# EAGLE design SparkFun_XBee_Arduino_Shield_Qwiic (EAGLE 9.6.2)
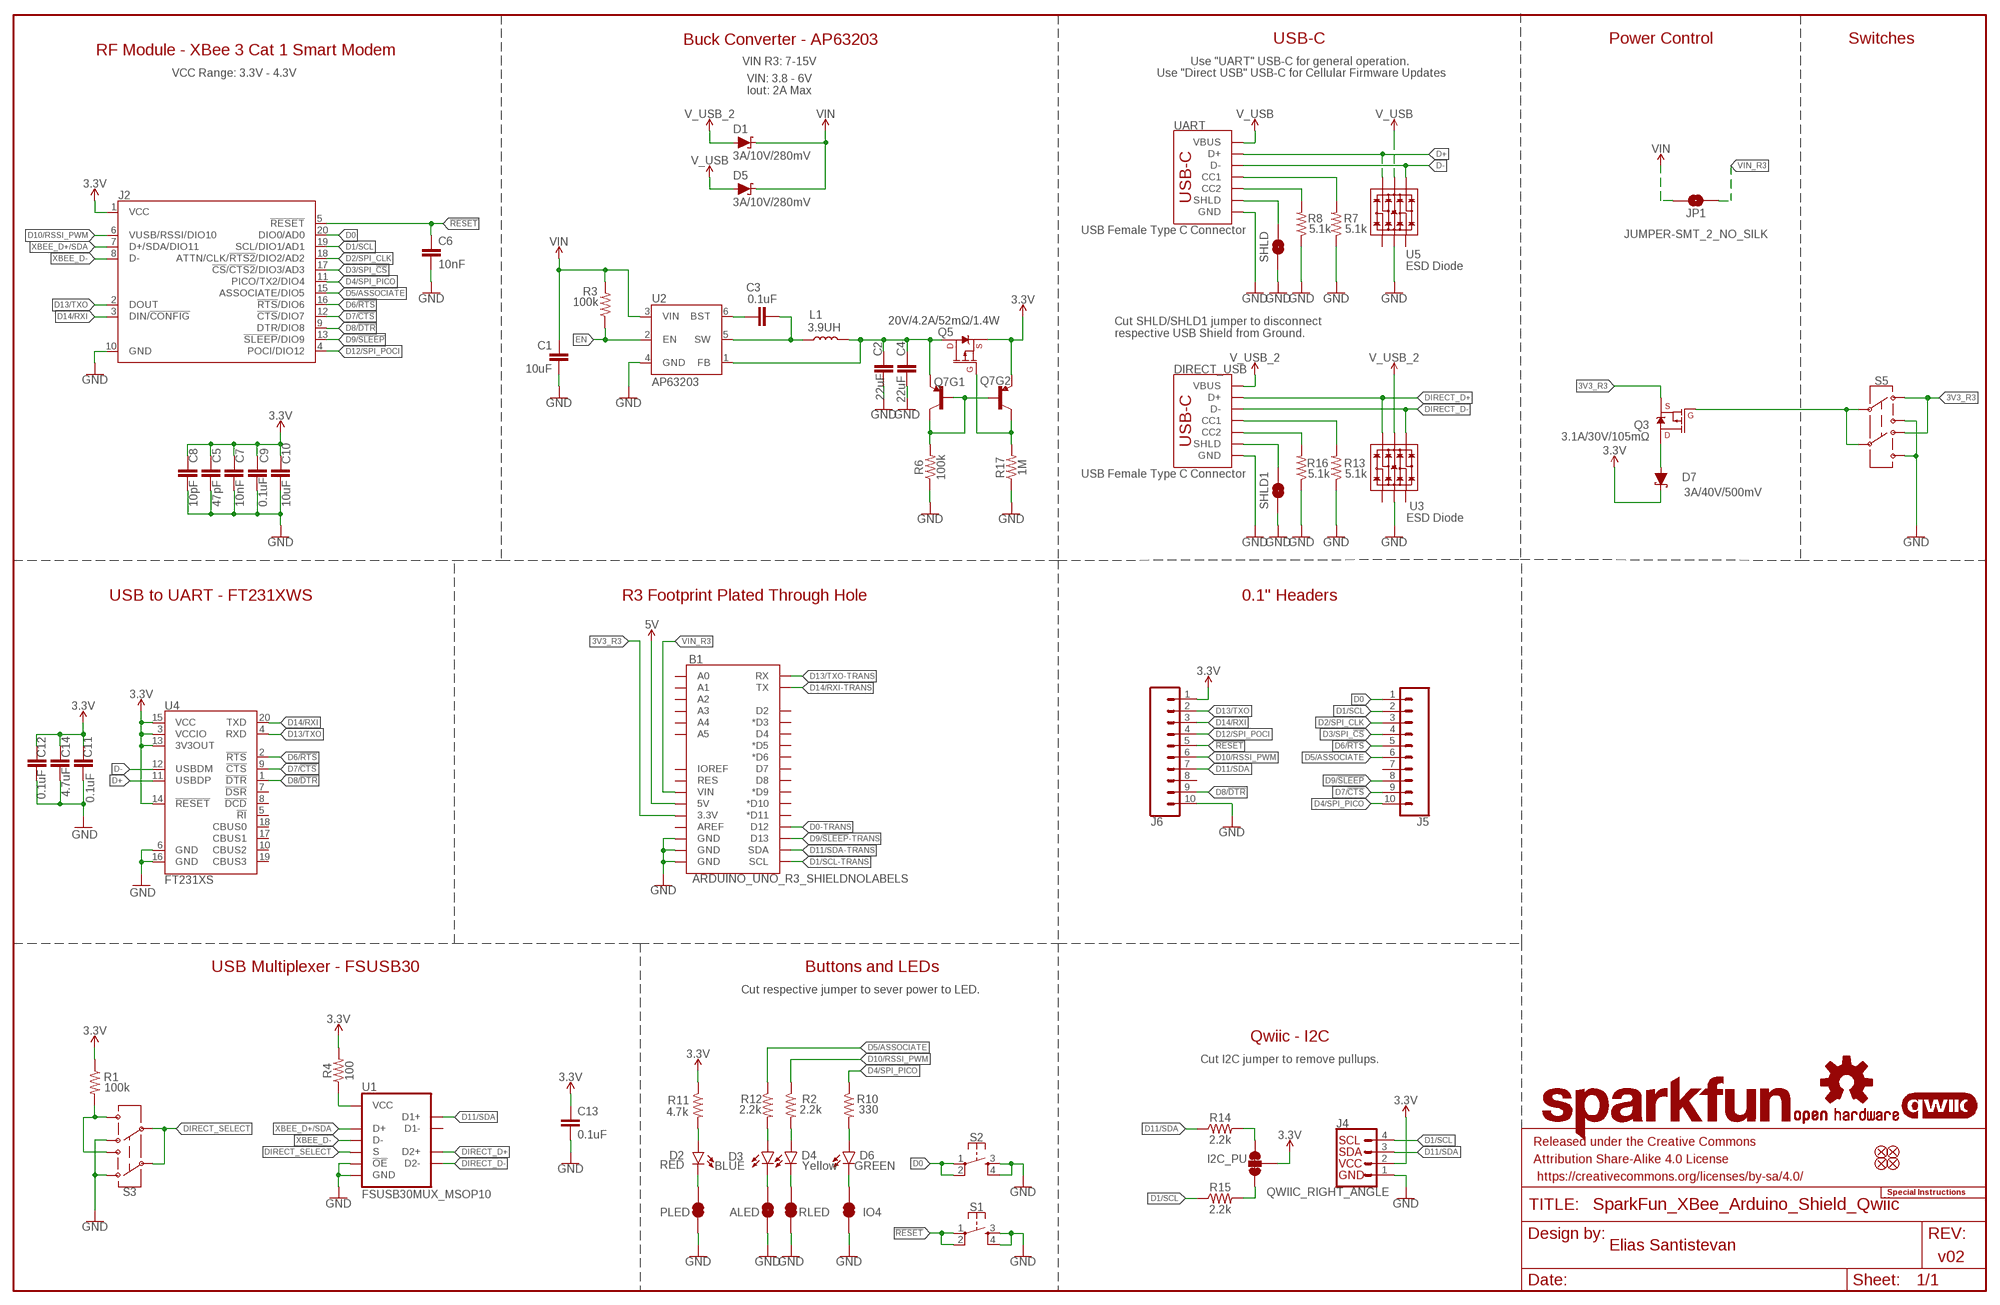
[diagram p0: schematic, sheet 1]

## Parts
ALED  JUMPER-SMT_2_NC_TRACE_SILK  [SMT-JUMPER_2_NC_TRACE_SILK]
B1  ARDUINO_UNO_R3_SHIELDNOLABELS  [UNO_R3_SHIELD_NOLABELS]
C1  10uF  10UF-1210-50V-20%  [1210]
C2  22uF  22UF-0603-6.3V-20%  [0603]
C3  0.1uF  0.1UF-0603-25V-5%  [0603]
C4  22uF  22UF-0603-6.3V-20%  [0603]
C5  47pF  47PF-0603-50V-5%  [0603]
C6  10nF  10NF-0603-50V-10%  [0603]
C7  10nF  10NF-0603-50V-10%  [0603]
C8  10pF  10PF-0603-50V-5%  [0603]
C9  0.1uF  0.1UF-0603-25V-(+80/-20%)  [0603]
C10  10uF  10UF-0603-6.3V-20%  [0603]
C11  0.1uF  0.1UF-0603-25V-(+80/-20%)  [0603]
C12  0.1uF  0.1UF-0603-25V-(+80/-20%)  [0603]
C13  0.1uF  0.1UF-0603-25V-(+80/-20%)  [0603]
C14  4.7uF  4.7UF-0603-6.3V-(10%)  [0603]
D1  3A/10V/280mV  DIODE-SCHOTTKY-BAT60A  [SOD-323]
D2  RED  LED-RED_0603-KB  [LED-0603]
D3  BLUE  LED-BLUE0603  [LED-0603]
D4  Yellow  LED-YELLOW0603  [LED-0603]
D5  3A/10V/280mV  DIODE-SCHOTTKY-BAT60A  [SOD-323]
D6  GREEN  LED-GREEN0603  [LED-0603]
D7  3A/40V/500mV  DIODE-SCHOTTKY-B340A  [SMA-DIODE]
DIRECT_USB  USB Female Type C Connector  USB_C_4-LAYER-ISOLATED  [USB-C-16P-4LAYER-ISOLATED]
FD1  FIDUCIAL1X2  [FIDUCIAL-1X2]
FD2  FIDUCIAL1X2  [FIDUCIAL-1X2]
FD3  FIDUCIAL1X2  [FIDUCIAL-1X2]
FD4  FIDUCIAL1X2  [FIDUCIAL-1X2]
FRAME1  FRAME-LEDGER  [CREATIVE_COMMONS]
I2C_PU  JUMPER-SMT_3_2-NC_TRACE_SILK  [SMT-JUMPER_3_2-NC_TRACE_SILK]
IO4  JUMPER-SMT_2_NC_TRACE_SILK  [SMT-JUMPER_2_NC_TRACE_SILK]
J2  XBEE_UPDATEXBEE_SMD  [XBEE3-SMD]
J4  QWIIC_RIGHT_ANGLE  QWIIC_CONNECTORJS-1MM  [JST04_1MM_RA]
J5  CONN_10NO_SILK_PTH_FEMALE  [1X10_NO_SILK]
J6  CONN_10NO_SILK_PTH_FEMALE  [1X10_NO_SILK]
JP1  JUMPER-SMT_2_NO_SILK  [SMT-JUMPER_2_NO_SILK]
L1  3.9UH  [INDUCTOR_3.9UH]
LOGO1  SFE_LOGO_NAMEBLANK  [BLANK]
LOGO2  OSHW-LOGOS  [OSHW-LOGO-S]
LOGO3  QWIIC_LOGO_4MM  [QWIIC_4MM]
LOGO4  SPECIAL_INSTRUCTIONS-ORDERING  [ORDERING_INSTRUCTIONS]
PLED  JUMPER-SMT_2_NC_TRACE_SILK  [SMT-JUMPER_2_NC_TRACE_SILK]
Q3  3.1A/30V/105mΩ  MOSFET_PCH-DMG2307L  [SOT23-3]
Q5  20V/4.2A/52mΩ/1.4W  MOSFET_PCH-DMG2305UX-7  [SOT23-3]
Q7  TRANS_PNP_DUALSOT-363  [SOT363_PHILIPS]
R1  100k  100KOHM-0603-1/10W-1%  [0603]
R2  2.2k  2.2KOHM-0603-1/10W-1%  [0603]
R3  100k  100KOHM-0603-1/10W-1%  [0603]
R4  100  100OHM-0603-1/10W-1%  [0603]
R6  100k  100KOHM-0603-1/10W-1%  [0603]
R7  5.1k  5.1KOHM5.1KOHM-0603-1/10W-1%  [0603]
R8  5.1k  5.1KOHM5.1KOHM-0603-1/10W-1%  [0603]
R10  330  330OHM-0603-1/10W-1%  [0603]
R11  4.7k  4.7KOHM-0603-1/10W-1%  [0603]
R12  2.2k  2.2KOHM-0603-1/10W-1%  [0603]
R13  5.1k  5.1KOHM5.1KOHM-0603-1/10W-1%  [0603]
R14  2.2k  2.2KOHM-0603-1/10W-1%  [0603]
R15  2.2k  2.2KOHM-0603-1/10W-1%  [0603]
R16  5.1k  5.1KOHM5.1KOHM-0603-1/10W-1%  [0603]
R17  1M  1MOHM-0603-1/4W-5%  [0603]
RLED  JUMPER-SMT_2_NC_TRACE_SILK  [SMT-JUMPER_2_NC_TRACE_SILK]
S1  MOMENTARY-SWITCH-SPST-2-SMD-5.2MM-TALL  [TACTILE_SWITCH_SMD_5.2MM]
S2  MOMENTARY-SWITCH-SPST-2-SMD-5.2MM-TALL  [TACTILE_SWITCH_SMD_5.2MM]
S3  SWITCH-DPDT-SMD-AYZ0202  [SWITCH_DPDT_SMD_AYZ0202]
S5  SWITCH-DPDT-SMD-AYZ0202  [SWITCH_DPDT_SMD_AYZ0202]
SHLD  JUMPER-SMT_2_NC_TRACE_SILK  [SMT-JUMPER_2_NC_TRACE_SILK]
SHLD1  JUMPER-SMT_2_NC_TRACE_SILK  [SMT-JUMPER_2_NC_TRACE_SILK]
U1  FSUSB30MUX_MSOP10  [MSOP10]
U2  AP63203  [SOT23-6]
U3  ESD Diode  TVS_DIODE_ARRAY_DT1042-04SO-7  [SOT-23-6]
U4  FT231XS  [SSOP20_L]
U5  ESD Diode  TVS_DIODE_ARRAY_DT1042-04SO-7  [SOT-23-6]
UART  USB Female Type C Connector  USB_C_4-LAYER-ISOLATED  [USB-C-16P-4LAYER-ISOLATED]

## Nets
3.3V: C5.1 C7.1 C8.1 C9.1 C10.1 C11.1 C12.1 C13.1 C14.1 D7.C I2C_PU.2 J2.1(VCC) J4.2 J6.1 Q5.2(S) Q7.4(E) R1.1 R4.2 R11.1 U4.3(VCCIO) U4.13(3V3OUT) U4.14(!RESET) U4.15(VCC)
3.3V_VREG: C2.1 C4.1 L1.P$2 Q5.3(D) Q7.1(E) U2.1(FB)
3V3_R3: B1.3.3V Q3.2(S) S5.3 S5.6
5V: B1.5V
!RESET!: C6.1 J2.5(!RESET!) J6.5 S1.1 S1.2
D0: J2.20(DIO0/AD0) J5.1 S2.1 S2.2
D0-TRANS: B1.D12
D1/SCL: J2.19(SCL/DIO1/AD1) J4.4 J5.2 R15.1
D1/SCL-TRANS: B1.SCL
D2/SPI_CLK: J2.18(ATTN/CLK/!RTS2!/DIO2/AD2) J5.3
D3/SPI_!CS!: J2.17(!CS!/!CTS2!/DIO3/AD3) J5.4
D4/SPI_PICO: J2.11(PICO/TX2/DIO4) J5.10 R10.1
D5/ASSOCIATE: J2.15(ASSOCIATE/DIO5) J5.6 R12.1
D6/!RTS!: J2.16(!RTS!/DIO6) J5.5 U4.2(!RTS)
D7/!CTS!: J2.12(!CTS!/DIO7) J5.9 U4.9(!CTS)
D8/!DTR!: J2.9(DTR/DIO8) J6.9 U4.1(!DTR)
D9/!SLEEP!: J2.13(!SLEEP!/DIO9) J5.8
D9/!SLEEP!-TRANS: B1.D13
D10/RSSI_PWM: J2.6(VUSB/RSSI/DIO10) J6.6 R2.1
D11/SDA: J4.3 J6.7 R14.1 U1.2(D1+)
D11/SDA-TRANS: B1.SDA
D12/SPI_POCI: J2.4(POCI/DIO12) J6.4
D13/TXO: J2.2(DOUT) J6.2 U4.4(RXD)
D13/TXO-TRANS: B1.RX
D14/RXI: J2.3(DIN/!CONFIG!) J6.3 U4.20(TXD)
D14/RXI-TRANS: B1.TX
D+ [Diff pairs]: U4.11(USBDP) U5.6(IO4) UART.A6(D+) UART.B6(D+)
D- [Diff pairs]: U4.12(USBDM) U5.4(IO3) UART.A7(D-) UART.B7(D-)
DIRECT_D+ [Diff pairs]: DIRECT_USB.A6(D+) DIRECT_USB.B6(D+) U1.3(D2+) U3.6(IO4)
DIRECT_D- [Diff pairs]: DIRECT_USB.A7(D-) DIRECT_USB.B7(D-) U1.7(D2-) U3.4(IO3)
DIRECT_SELECT: S3.2 S3.5 U1.1(S)
DIRECT_USB: R1.2 S3.1 S3.4
EN: R3.1 U2.2(EN)
GND: ALED.1 B1.GND@0(GND) B1.GND@1(GND) B1.GND@2(GND) C1.2 C2.2 C4.2 C5.2 C6.2 C7.2 C8.2 C9.2 C10.2 C11.2 C12.2 C13.2 C14.2 DIRECT_USB.GND DIRECT_USB.GND2(GND) IO4.1 J2.10(GND) J4.1 J6.10 PLED.1 R6.1 R7.1 R8.1 R13.1 R16.1 R17.1 RLED.1 S1.3 S1.4 S2.3 S2.4 S3.3 S3.6 S5.1 S5.4 SHLD1.1 SHLD.1 U1.5(GND) U1.9(!OE!) U2.4(GND) U3.2(VSS) U4.6(GND) U4.16(GND) U5.2(VSS) UART.GND UART.GND2(GND)
N$1: C3.1 U2.6(BST)
N$2: D4.A R2.2
N$3: D4.C RLED.2
N$4: D6.A R10.2
N$5: R8.2 UART.B5(CC2)
N$6: R7.2 UART.A5(CC1)
N$7: D2.A R11.2
N$8: C3.2 L1.P$1 U2.5(SW)
N$10: R4.1 U1.10(VCC)
N$11: I2C_PU.3 R14.2
N$12: D3.A R12.2
N$13: I2C_PU.1 R15.2
N$14: DIRECT_USB.B5(CC2) R16.2
N$15: DIRECT_USB.A5(CC1) R13.2
N$16: D7.A Q3.3(D)
N$17: D6.C IO4.2
N$19: Q7.2(B) Q7.5(B) Q7.6(C) R6.2
N$20: Q5.1(G) Q7.3(C) R17.2
N$21: ALED.2 D3.C
N$23: D2.C PLED.2
N$27: Q3.1(G) S5.2 S5.5
SHLD: SHLD.2 UART.SHLD1(SHLD) UART.SHLD2(SHLD) UART.SHLD3(SHLD) UART.SHLD4(SHLD) UART.SHLD5(SHLD) UART.SHLD6(SHLD) UART.SHLD7(SHLD) UART.SHLD8(SHLD)
SHLD1: DIRECT_USB.SHLD1(SHLD) DIRECT_USB.SHLD2(SHLD) DIRECT_USB.SHLD3(SHLD) DIRECT_USB.SHLD4(SHLD) DIRECT_USB.SHLD5(SHLD) DIRECT_USB.SHLD6(SHLD) DIRECT_USB.SHLD7(SHLD) DIRECT_USB.SHLD8(SHLD) SHLD1.2
V_USB: D5.A U5.5(VCC) UART.VBUS1(VBUS) UART.VBUS2(VBUS)
V_USB_2: D1.A DIRECT_USB.VBUS1(VBUS) DIRECT_USB.VBUS2(VBUS) U3.5(VCC)
VIN: C1.1 D1.C D5.C JP1.2 R3.2 U2.3(VIN)
VIN_R3: B1.VIN JP1.1
XBEE_D+/SDA [Diff pairs]: J2.7(D+/SDA/DIO11) U1.4(D+)
XBEE_D- [Diff pairs]: J2.8(D-) U1.6(D-)
Unconnected: B1.A0 B1.A1 B1.A2 B1.A3 B1.A4 B1.A5 B1.AREF B1.D2 B1.D3(*D3) B1.D4 B1.D5(*D5) B1.D6(*D6) B1.D7 B1.D8 B1.D9(*D9) B1.D10(*D10) B1.D11(*D11) B1.IOREF B1.RES J5.7 J6.8 U1.8(D1-) U3.1(IO1) U3.3(IO2) U4.5(!RI) U4.7(!DSR) U4.8(!DCD) U4.10(CBUS2) U4.17(CBUS1) U4.18(CBUS0) U4.19(CBUS3) U5.1(IO1) U5.3(IO2)

## Notes on the sheet
- Buck Converter - AP63203 | USB-C | Power Control | Switches
- RF Module - XBee 3 Cat 1 Smart Modem
- VIN R3: 7-15V | Use "UART" USB-C for general operation.
- VCC Range: 3.3V - 4.3V | Use "Direct USB" USB-C for Cellular Firmware Updates
- VIN: 3.8 - 6V
  Iout: 2A Max
- Cut SHLD/SHLD1 jumper to disconnect
  respective USB Shield from Ground.
- USB to UART - FT231XWS | R3 Footprint Plated Through Hole | 0.1" Headers
- USB Multiplexer - FSUSB30 | Buttons and LEDs
- Cut respective jumper to sever power to LED.
- Qwiic - I2C
- Cut I2C jumper to remove pullups.
- Elias Santistevan
- v02

## Library data of the parts
ALED IO4 PLED RLED SHLD SHLD1 = SparkFun-Jumpers:JUMPER-SMT_2_NC_TRACE: Normally closed trace jumper This jumper has a trace between two pads so it's normally closed (NC). Use a razor knife to open the connection. For best results follow the IPC guidelines for cutting traces: Cutout at least 0.063 mm (0.005 in). Remove all loose material to clean up the cut area. Seal the cut with an approved epoxy. Reapply solder to reclose the connection.
B1 = SparkFun-Boards:ARDUINO_UNO_R3_SHIELD: Arduino R3 Shield Footprint Shield form compatible with the Arduino Uno R3. SparkFun Products: MG2639 Cellular Shield <https://www.sparkfun.com/products/13120> MIDI Shield <https://www.sparkfun.com/products/12898> R3 Stackable Headers Kit <https://www.sparkfun.com/products/11417>
C1 = SparkFun-Capacitors:10UF: 10.0µF ceramic capacitors A capacitor is a passive two-terminal electrical component used to store electrical energy temporarily in an electric field.; PROD_ID: CAP-09824
C2 C4 = SparkFun-Capacitors:22UF: 22µF ceramic capacitors A capacitor is a passive two-terminal electrical component used to store electrical energy temporarily in an electric field.; PROD_ID: CAP-14464
C3 = SparkFun-Capacitors:0.1UF: 0.1µF ceramic capacitors A capacitor is a passive two-terminal electrical component used to store electrical energy temporarily in an electric field.; PROD_ID: CAP-08604
C5 = SparkFun-Capacitors:47PF: 47pF ceramic capacitors A capacitor is a passive two-terminal electrical component used to store electrical energy temporarily in an electric field.; PROD_ID: CAP-08913
C6 C7 = SparkFun-Capacitors:10NF: 0.01uF/10nF/10,000pF ceramic capacitors A capacitor is a passive two-terminal electrical component used to store electrical energy temporarily in an electric field. CAP-09321; PROD_ID: CAP-00867
C8 = SparkFun-Capacitors:10PF: 10pF ceramic capacitors A capacitor is a passive two-terminal electrical component used to store electrical energy temporarily in an electric field.; PROD_ID: CAP-11812
C9 C11-C13 = SparkFun-Capacitors:0.1UF: 0.1µF ceramic capacitors A capacitor is a passive two-terminal electrical component used to store electrical energy temporarily in an electric field.; PROD_ID: CAP-00810
C10 = SparkFun-Capacitors:10UF: 10.0µF ceramic capacitors A capacitor is a passive two-terminal electrical component used to store electrical energy temporarily in an electric field.; PROD_ID: CAP-11015
C14 = SparkFun-Capacitors:4.7UF: 4.7µF ceramic capacitors A capacitor is a passive two-terminal electrical component used to store electrical energy temporarily in an electric field.; PROD_ID: CAP-08280
D1 D5 = SparkFun-DiscreteSemi:DIODE-SCHOTTKY: Schottky diode A Schottky diode is a semiconductor diode which has a low forward voltage drop and a very fast switching action.; PROD_ID: DIO-14072
D2 = SparkFun-LED:LED-RED: Red SMD LED Used in manufacturing of most products at SparkFun Packages: 0603 - KB - KingBright (DIO-17976) SMD 0603 package [Datasheet] <https://www.kingbrightusa.com/images/catalog/SPEC/APT1608SURCK.pdf> 0603 - (DIO-00819, has gone EOL) SMD 0603 package 0603 SMART - SMD 0603 SMART package ( more efficient and expensive)[Product Link] <http://www.osram-os.com/Graphics/XPic2/00077099_0.pdf> 1206 - SMD1206 package [Product Link] <https://www.sparkfun.com/datasheets/DevTools/LilyPad/Q150OVS4.pdff> SparkFun Products: Pro Mini 328 -5V <https://www.sparkfun.com/products/821> RedBoard <https://www.sparkfun.com/products/12757> IOIO-OTG <https://www.sparkfun.com/products/13613>; PROD_ID: DIO-17976
D3 = SparkFun-LED:LED-BLUE: Blue SMD LED Used in manufacturing of various products at SparkFun Packages: 0603 - SMD 0603 package [Product Link] <http://www.digikey.com/product-detail/en/SMLE12BC7TT86/511-1589-2-ND/1641808> 1206 - SMD1206 package [Product Link] <http://www.digikey.com/product-detail/en/lite-on-inc/LTST-C150TBKT/160-1643-1-ND/573584> SparkFun Products: ESP8266 Thing-Dev Board <https://www.sparkfun.com/products/13711> RedBoard <https://www.sparkfun.com/products/12757>; PROD_ID: DIO-08575
D4 = SparkFun-LED:LED-YELLOW: Yellow SMD LED Used in manufacturing several products at SparkFun. Packages: 0603 - SMD 0603 package[Product Link] <http://www.kingbrightusa.com/product.asp?catalog_name=LED&product_id=APT1608SYCK> 0603 -SMART - SMART SMD 0603 package (more efficient/more expensive) [Product Link] <http://www.osram-os.com/osram_os/en/products/product-catalog/led-light-emitting-diodes/smartled-0603/ly-l29k/index.jsp> LilyPad - SMD1206 package[Product Datasheet] <https://www.sparkfun.com/datasheets/DevTools/LilyPad/Q150YUS4.pdf> SparkFun Products: Blynk Board <https://www.sparkfun.com/products/13794> IOIO-OTG <https://www.sparkfun.com/products/13613> XBee Explorer Serial <https://www.sparkfun.com/products/13225>; PROD_ID: DIO-09003
D6 = SparkFun-LED:LED-GREEN: Green SMD LED Used in manufacturing of various products at SparkFun Packages: 0603 - SMD 0603 package [Product Link] <http://www.futureelectronics.com/en/technologies/semiconductors/optoelectronics/leds/Pages/9894312-LTST-C190GKT.aspx?CrossPart=HSMG-C190&IM=0> LilyPad 1206 - SMD1206 LilyPad package [Product Link] <http://www.futureelectronics.com/en/Technologies/Product.aspx?ProductID=IN150NGHARVATEKCORPORATION2049943&IM=0> 1206 - SMD1206 package [Product Link] <http://www.futureelectronics.com/en/technologies/semiconductors/optoelectronics/leds/Pages/8315665-LTST-C150KGKT.aspx?IM=0> 1206 Bottom Mount -SMD 1206 Bottom Mount [Product Link] <http://www.digikey.com/product-detail/en/lite-on-inc/LTST-C230KGKT/160-1456-1-ND/386854> SparkFun Products: Pro Mini 328 -5V <https://www.sparkfun.com/products/821> RedBoard <https://www.sparkfun.com/products/12757> MP3 Trigger <https://www.sparkfun.com/products/13720> Makey Makey <https://www.sparkfun.com/products/11076>; PROD_ID: DIO-00821
D7 = SparkFun-DiscreteSemi:DIODE-SCHOTTKY: Schottky diode A Schottky diode is a semiconductor diode which has a low forward voltage drop and a very fast switching action.; PROD_ID: DIO-09886
DIRECT_USB UART = SparkFun-Connectors:USB_C: USB Type C 16Pin Connector Super Speed pins not available on the 16-pin purely SMD connector so this part is best for USB 2.0 implementations. D1 and D2 are tied together enabling D+/- no matter which way the cable is plugged into the connector. The two channel configuration pins (CC1/2) are exposed. These are normally connected to ground via 5.1k resistors but can be reconfigured for high current/high power applications. **4-LAYER BOARD WARNING!!** If designing 4-layer board, make sure to select the variant _4-LAYER-ISOLATED. The linked footprint (USB-C-16-4LAYER-ISOLATED) includes some very necessary cutout polygons in the inner layers (2 and 15). This prevents the PTH mounting shield legs on the USB connector from electrically connecting any other polygons on the inner layers (usually VCC and GND).; PROD_ID: CONN-14122
FD1-FD4 = SparkFun-Aesthetics:FIDUCIAL: Fiducial Alignment Points Point-of-reference for pick-and-place machines and other optical instruments.
FRAME1 = SparkFun-Aesthetics:FRAME-LEDGER: Schematic Frame - Ledger Standard 11x14 US Ledger frame
I2C_PU = SparkFun-Jumpers:JUMPER-SMT_3_2-NC_TRACE: Normally closed trace jumper (2 of 2 connections) This jumper has a trace between all three pads so they are normally closed (NC). Use a razor knife to open the connection(s). For best results follow the IPC guidelines for cutting traces: Cutout at least 0.063 mm (0.005 in). Remove all loose material to clean up the cut area. Seal the cut with an approved epoxy. Reapply solder to reclose the connection(s).
J2 = xbee_smart_modem:XBEE_UPDATE: XBee 3 Cat 1 Smart Modem
J4 = SparkFun-Connectors:QWIIC_CONNECTOR: SparkFun I2C Standard Qwiic Connector An SMD 1mm pitch JST connector makes it easy and quick (get it? Qwiic?) to connect I2C devices to each other. The Qwiic system <http://www.sparkfun.com/qwiic> enables fast and solderless connection between popular platforms and various sensors and actuators. We carry 200mm <https://www.sparkfun.com/products/14204>, 100mm <https://www.sparkfun.com/products/14205>, 50mm <https://www.sparkfun.com/products/14206>, and breadboard friendly <https://www.sparkfun.com/products/14207> Qwiic cables. We also offer 10 pcs strips <https://www.sparkfun.com/products/14323> the SMD connectors.; PROD_ID: CONN-13694
J5 J6 = SparkFun-Connectors:CONN_10: Multi connection point. Often used as Generic Header-pin footprint for 0.1 inch spaced/style header connections On any of the 0.1 inch spaced packages, you can populate with these: Break Away Headers - Straight <https://www.sparkfun.com/products/116> (PRT-00116) Break Away Male Headers - Right Angle <https://www.sparkfun.com/products/553> (PRT-00553) Female Headers <https://www.sparkfun.com/products/115> (PRT-00115) Break Away Headers - Machine Pin <https://www.sparkfun.com/products/117> (PRT-00117) Break Away Female Headers - Swiss Machine Pin <https://www.sparkfun.com/products/743> (PRT-00743) Arduino Stackable Header - 10 Pin <https://www.sparkfun.com/products/11376> (PRT-11376) For SCREWTERMINALS and SPRING TERMINALS visit here: Screw Terimnals on SparkFun.com <https://www.sparkfun.com/search/results?term=Screw+Terminals> (5mm/3.5mm/2.54mm spacing) This device is also useful as a general connection point to wire up your design to another part of your project. Our various solder wires solder well into these plated through hole pads. Hook-Up Wire - Assortment (Stranded, 22 AWG) <https://www.sparkfun.com/products/11375> (PRT-11375) Hook-Up Wire - Assortment (Solid Core, 22 AWG) <https://www.sparkfun.com/products/11367> (PRT-11367) View the entire wire category on our website here <https://www.sparkfun.com/categories/141> Special notes: Molex polarized connector foot print use with SKU : PRT-08231 with associated crimp pins and housings. 1MM SMD Version SKU: PRT-10208 NOTES ON THE VARIANTS LOCK and LOCK_LONGPADS... This footprint was designed to help hold the alignment of a through-hole component (i.e. 6-pin header) while soldering it into place. You may notice that each hole has been shifted either up or down by 0.005 of an inch from it's more standard position (which is a perfectly straight line). This slight alteration caused the pins (the squares in the middle) to touch the edges of the holes. Because they are alternating, it causes a "brace" to hold the component in place. 0.005 has proven to be the perfect amount of "off-center" position when using our standard breakaway headers. Although looks a little odd when you look at the bare footprint, once you have a header in there, the alteration is very hard to notice. Also,if you push a header all the way into place, it is covered up entirely on the bottom side.
JP1 = SparkFun-Jumpers:JUMPER-SMT_2_NO: Normally open jumper This jumper has two pads in close proximity to each other. Apply solder to close the connection. Round pads are easier to solder for beginners, but are a lot larger. SparkFun Product that uses the round pads: SparkFun EL Sequencer <https://www.sparkfun.com/products/12781>
L1 = SparkFun-Coils:3.9UH: Würth's Electronik 3.9uH Inductor Characteristics 3.9uH 2.4A Current Rating 2.8A Saturation Inductance Frequency: 100kHzd AEC-Q200 Certified 5mm x 5mm Package 30% tolerance; PROD_ID: NDUC-18014
LOGO1 = SparkFun-Aesthetics:SFE_LOGO_NAME: SparkFun Font Logo This is the SparkFun name logo. The logo on the schematic will always be the same size; the package variant is the height of the flame part of the logo (or the height the flame would be, if it were drawn). Default layer for the logo on the board is tSilk.
LOGO2 = SparkFun-Aesthetics:OSHW-LOGO: Open-Source Hardware (OSHW) Logo This logo indicates the piece of hardware it is found on incorporates a OSHW license and/or adheres to the definition of open source hardware found here: http://freedomdefined.org/OSHW
LOGO3 = SparkFun-Aesthetics:QWIIC_LOGO: Qwiic Logos for placement on schematic and PCB. The 5.5mm silk logo is best for placing next to Qwiic connector.
LOGO4 = SparkFun-Aesthetics:SPECIAL_INSTRUCTIONS: Special Ordering/Production Instructions Alert Symbol for special PCB ordering instructions or unique production process warnings. Ordering Instructions Production Instructions Types of information that should be added to box: Copper weight Soldermask color Silk color PCB thickness Number of layers PCB Standard: 1.6mm FR4 1 oz copper immersion silver plating red soldermask white silkscreen Types of information that should be added to box: Special wash requirements Depaneling instructions Humidification Glue curing Default text settings: 0.07 inch 9% ratio 50% line distance
Q3 = SparkFun-DiscreteSemi:MOSFET_PCH: P-channel MOSFETs Voltage controlled devices that allow control of high current outputs. SparkFun Products: SparkFun ESP32 Thing <https://www.sparkfun.com/products/13907> SparkFun ESP8266 Thing <https://www.sparkfun.com/products/13231> SparkFun Pi Servo HAT V2 <https://www.sparkfun.com/products/15316> DMG2305UX-7 (20V/4.2A/SOT23-3); PROD_ID: TRANS-11308
Q5 = SparkFun-DiscreteSemi:MOSFET_PCH: P-channel MOSFETs Voltage controlled devices that allow control of high current outputs. SparkFun Products: SparkFun ESP32 Thing <https://www.sparkfun.com/products/13907> SparkFun ESP8266 Thing <https://www.sparkfun.com/products/13231> SparkFun Pi Servo HAT V2 <https://www.sparkfun.com/products/15316> DMG2305UX-7 (20V/4.2A/SOT23-3); PROD_ID: TRANS-14388
Q7 = SparkFun-DiscreteSemi:TRANS_PNP_DUAL: Dual PNP Transistors in Single Package The BCM857BS puts two PNP transistors in a single package. Bipolar (BJT) Transistor Array 2 PNP (Dual) 45V 100mA 100MHz 200mW Surface Mount SOT-363 Datasheet <https://www.diodes.com/assets/Datasheets/BCM857BS.pdf> SparkFun Products: SparkFun Pi Servo HAT V2 <https://www.sparkfun.com>; PROD_ID: TRANS-14386
R1 R3 R6 = SparkFun-Resistors:100KOHM: 100kΩ resistor A resistor is a passive two-terminal electrical component that implements electrical resistance as a circuit element. Resistors act to reduce current flow, and, at the same time, act to lower voltage levels within circuits. - Wikipedia; PROD_ID: RES-07828
R2 R12 R14 R15 = SparkFun-Resistors:2.2KOHM: 2.2kΩ resistor A resistor is a passive two-terminal electrical component that implements electrical resistance as a circuit element. Resistors act to reduce current flow, and, at the same time, act to lower voltage levels within circuits. - Wikipedia; PROD_ID: RES-08272
R4 = SparkFun-Resistors:100OHM: 100Ω resistor A resistor is a passive two-terminal electrical component that implements electrical resistance as a circuit element. Resistors act to reduce current flow, and, at the same time, act to lower voltage levels within circuits. - Wikipedia; PROD_ID: RES-07863
R7 R8 R13 R16 = SparkFun-Resistors:5.1KOHM; PROD_ID: RES-12083
R10 = SparkFun-Resistors:330OHM: 330Ω resistor A resistor is a passive two-terminal electrical component that implements electrical resistance as a circuit element. Resistors act to reduce current flow, and, at the same time, act to lower voltage levels within circuits. - Wikipedia; PROD_ID: RES-00818
R11 = SparkFun-Resistors:4.7KOHM: 4.7kΩ resistor A resistor is a passive two-terminal electrical component that implements electrical resistance as a circuit element. Resistors act to reduce current flow, and, at the same time, act to lower voltage levels within circuits. - Wikipedia; PROD_ID: RES-07857
R17 = SparkFun-Resistors:1MOHM: 1MΩ resistor A resistor is a passive two-terminal electrical component that implements electrical resistance as a circuit element. Resistors act to reduce current flow, and, at the same time, act to lower voltage levels within circuits. - Wikipedia; PROD_ID: RES-07868
S1 S2 = SparkFun-Switches:MOMENTARY-SWITCH-SPST-2: Momentary Switch (Pushbutton) - SPST - Two Circuits Normally-open (NO) SPST momentary switches (buttons, pushbuttons). Schematic symbol includes two switch circuits. Variants SMD-4.6MMX2.8MM - 4.60mm x 2.80mm Tactile Momentary Button Switch - Used on SparkFun Pro Micro - RP2040 <https://www.sparkfun.com/products/17717> SMD-5.2MM - Mini Pushbutton Switch - SMD <https://www.sparkfun.com/products/8720> - Used on Arduino Pro Mini <https://www.sparkfun.com/products/11114>; PROD_ID: SWCH-14139
S3 S5 = SparkFun-Switches:SWITCH-DPDT: Double-Pole, Double-Throw (DPDT) Switch Double-pole, double-throw switches. Variant Overview PTH-GPI-152-3013 Used on SparkFun Geiger Counter <https://www.sparkfun.com/products/11345> SMD-AY0202 Surface Mount DPDT Switch <https://www.sparkfun.com/products/597> (COM-00597) Used on e.g. LilyPad Arduino USB - ATmega32U4 Board <https://www.sparkfun.com/products/12049>; PROD_ID: SWCH-08179; SF_SKU: COM-00597
U1 = SparkFun-IC-Special-Function:FSUSB30MUX; PROD_ID: IC-15569
U2 = SparkFun-IC-Power:AP63203: Diodes Inc. AP63203 3.8V-32V input 3.3V Buck The AP63200/AP63201/AP63203/AP63205 is a 2A, synchronous buck converter with a wide input voltage range of 3.8V to 32V and fully integrates a 125mΩ high-side power MOSFET and a 68mΩ lowside power MOSFET to provide high-efficiency step-down DC/DC conversion; PROD_ID: VREG-15244
U3 U5 = SparkFun-DiscreteSemi:TVS_DIODE_ARRAY; PROD_ID: IC-13538
U4 = SparkFun-IC-Comms:FT231X: FTDI FT231X Full Speed USB to Full-handshake UART This USB2.0 Full Speed IC offers a compact bridge to full handshake UART interfaces. The device is a UART, capable of operating up to 3MBaud, with low power consumption (8mA). The FT231X includes the complete FT-X series feature set and enables USB to be added into a system design quickly and easily over a UART interface. Datasheet <http://cdn.sparkfun.com/datasheets/Components/General%20IC/DS_FT231X.pdf> SparkFun Products SparkFun RedBoard - Programmed with Arduino <https://www.sparkfun.com/products/12757> (DEV-12757) SparkFun XBee Explorer USB <https://www.sparkfun.com/products/11812> (WRL-11812) SparkFun XBee Explorer Dongle <https://www.sparkfun.com/products/11697> (WRL-11697) SparkFun Blynk Board - ESP8266 <https://www.sparkfun.com/products/13794> (WRL-13794) SparkFun ESP8266 Thing - Dev Board <https://www.sparkfun.com/products/13711> (WRL-13711) SparkFun Block for Intel® Edison - Base <https://www.sparkfun.com/products/13045> (DEV-13045) SparkFun RedStick <https://www.sparkfun.com/products/13741> (DEV-13741) SparkFun Beefy 3 - FTDI Basic Breakout <https://www.sparkfun.com/products/13746> (DEV-13746) SparkFun FT231X Breakout <https://www.sparkfun.com/products/11736> (BOB-11736); PROD_ID: IC-11524

## Net classes
1 POWER: width 0.559 mm, drill 0.305 mm
2 Diff pairs: width 0.203 mm, drill 0.305 mm, clearance 0.152 mm

## Board
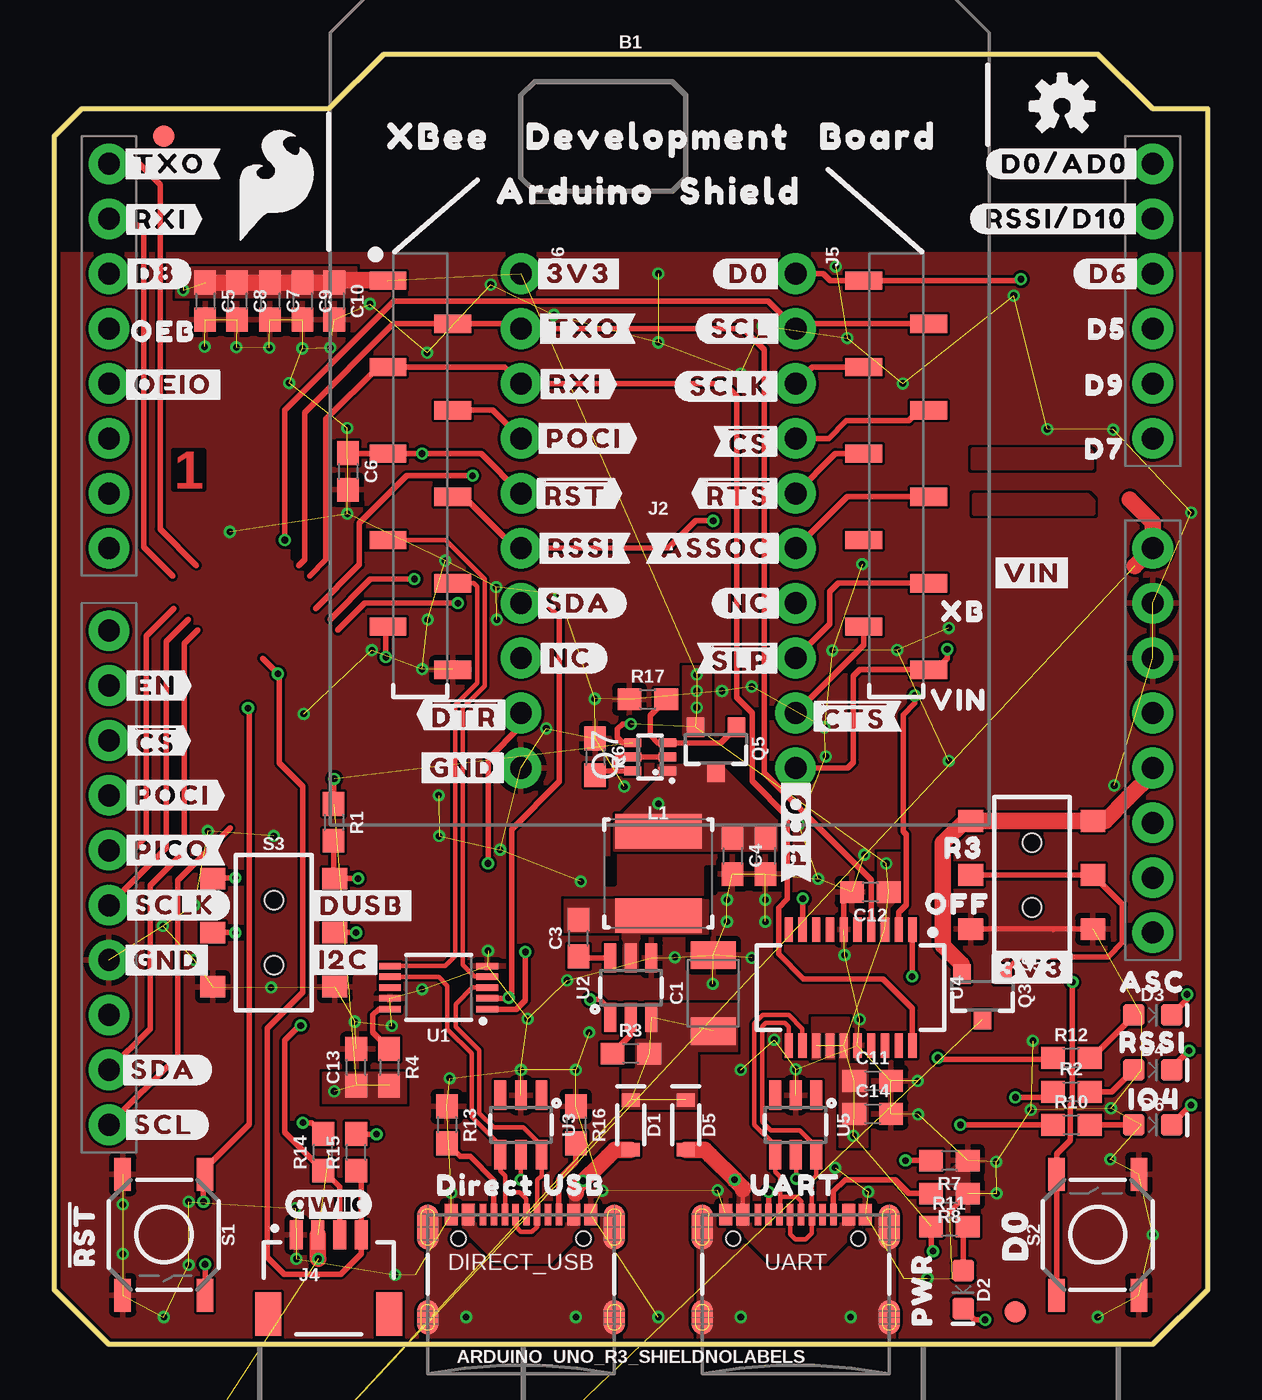
[diagram p1: board, top side]
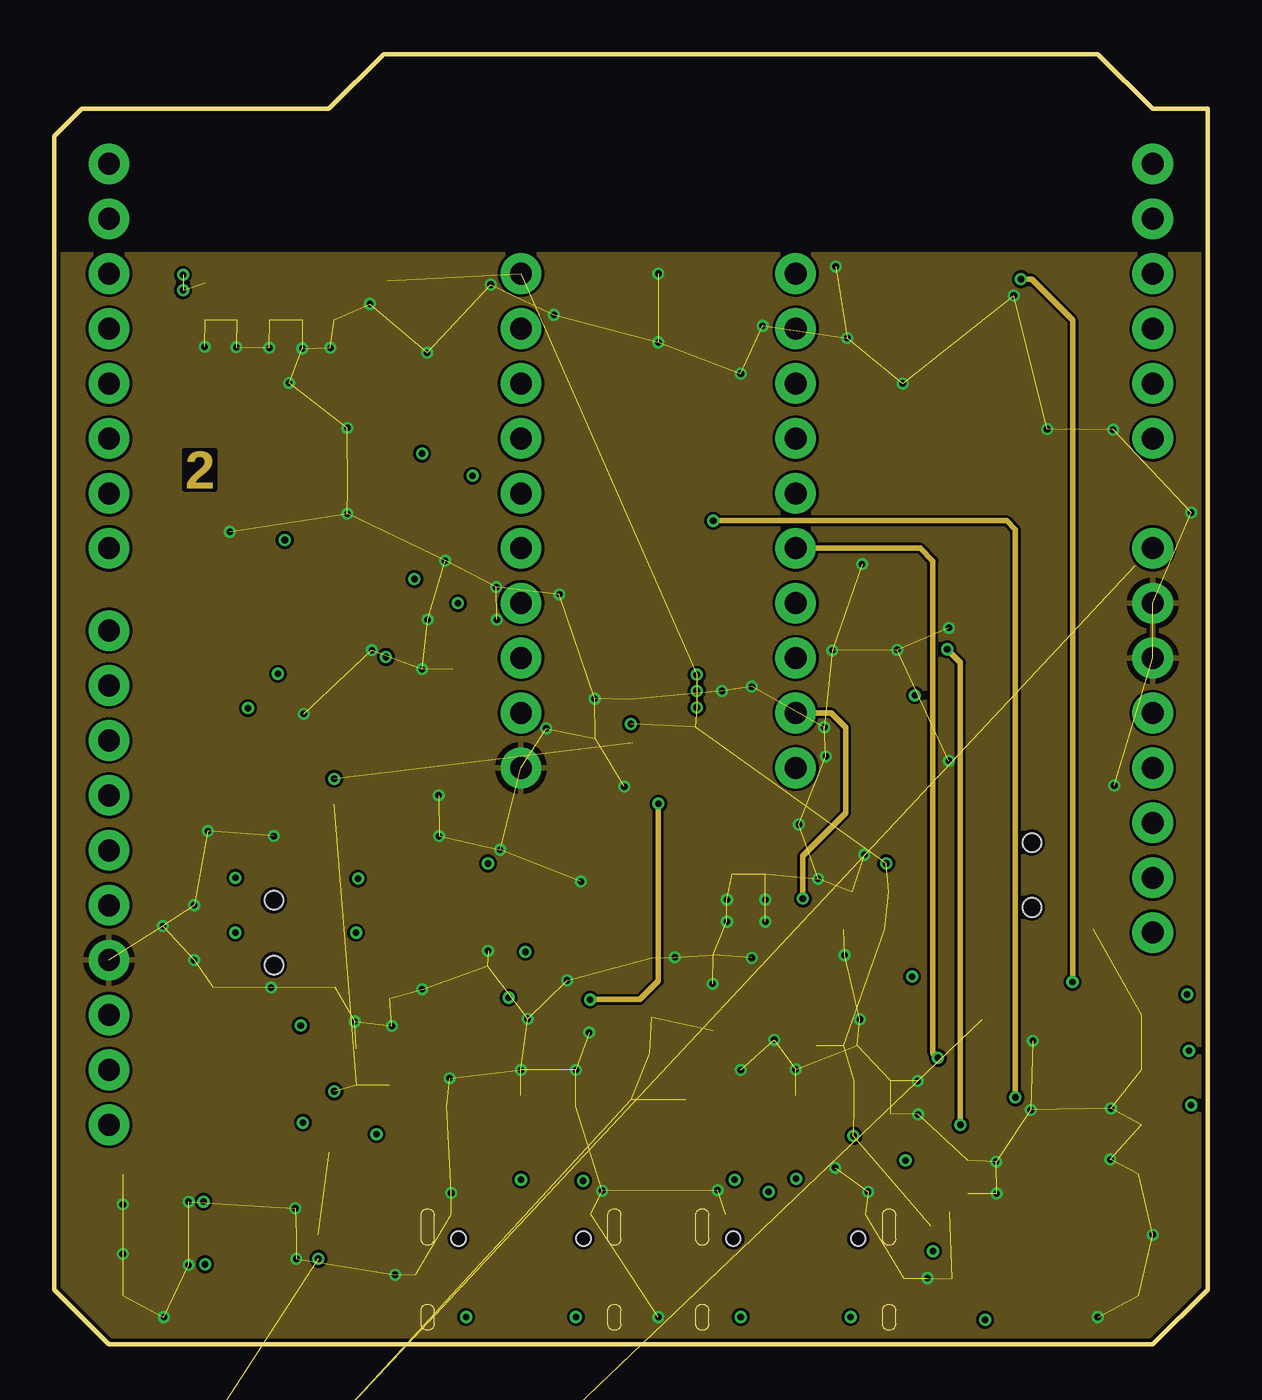
[diagram p2: board, inner layer Route2]
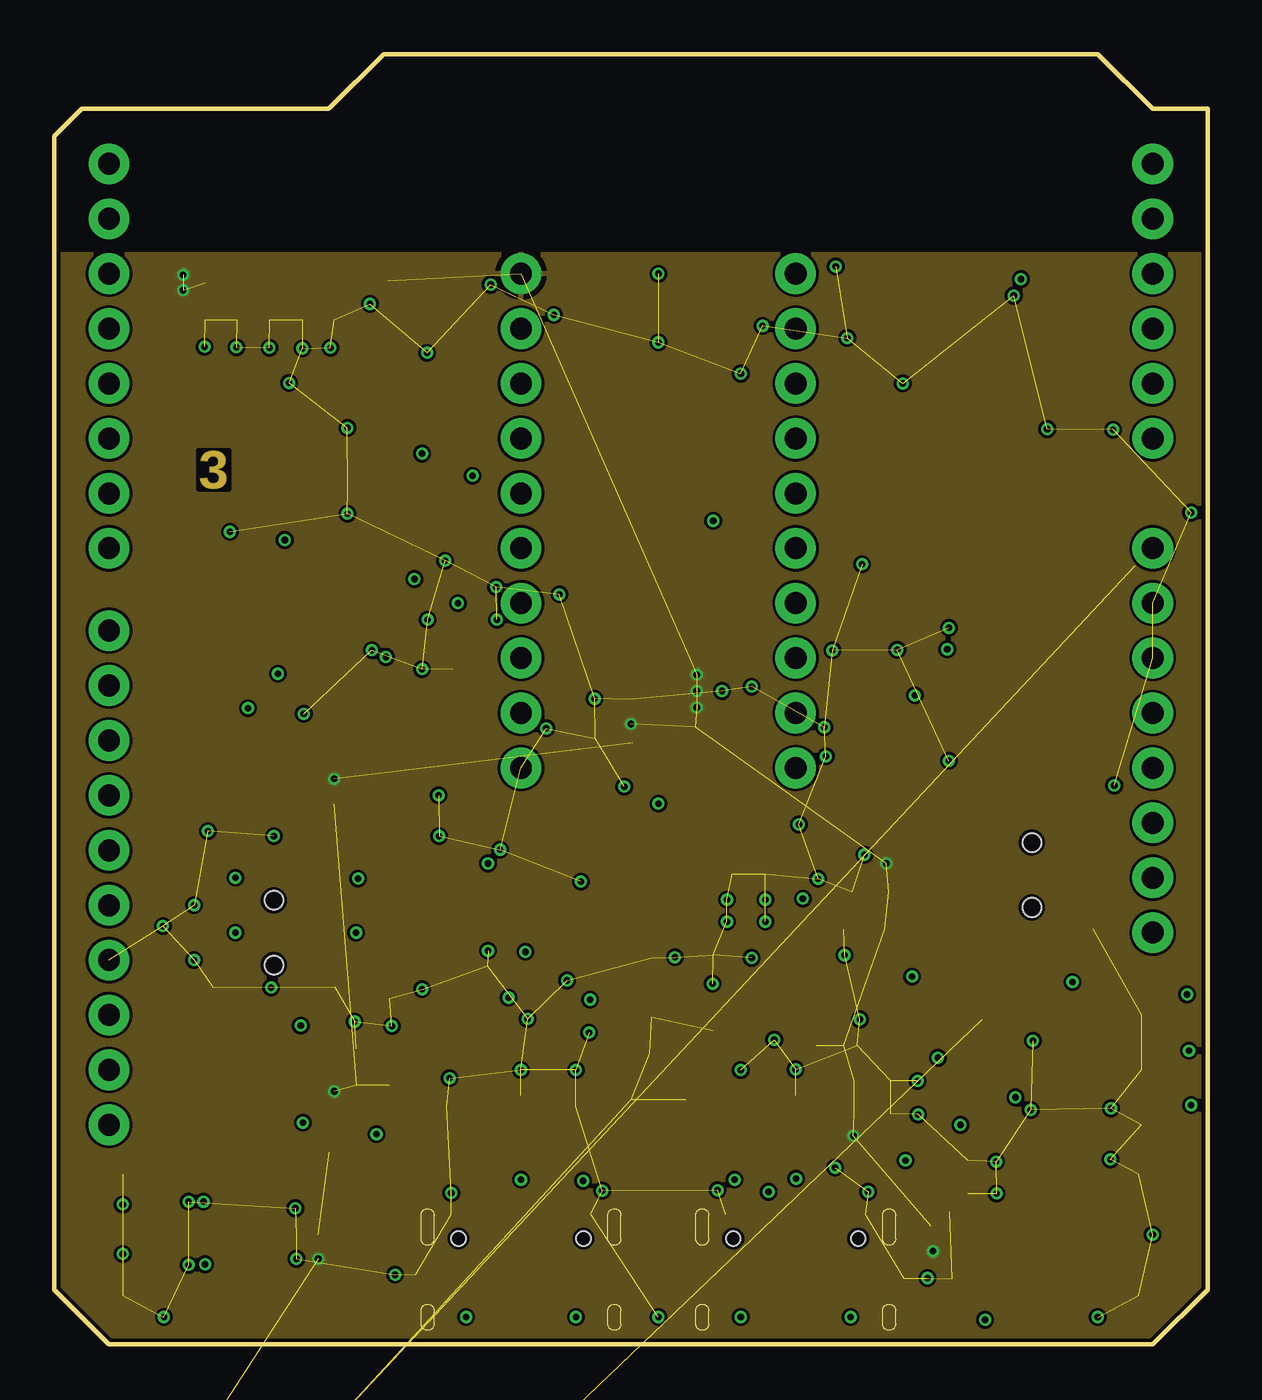
[diagram p3: board, inner layer Route15]
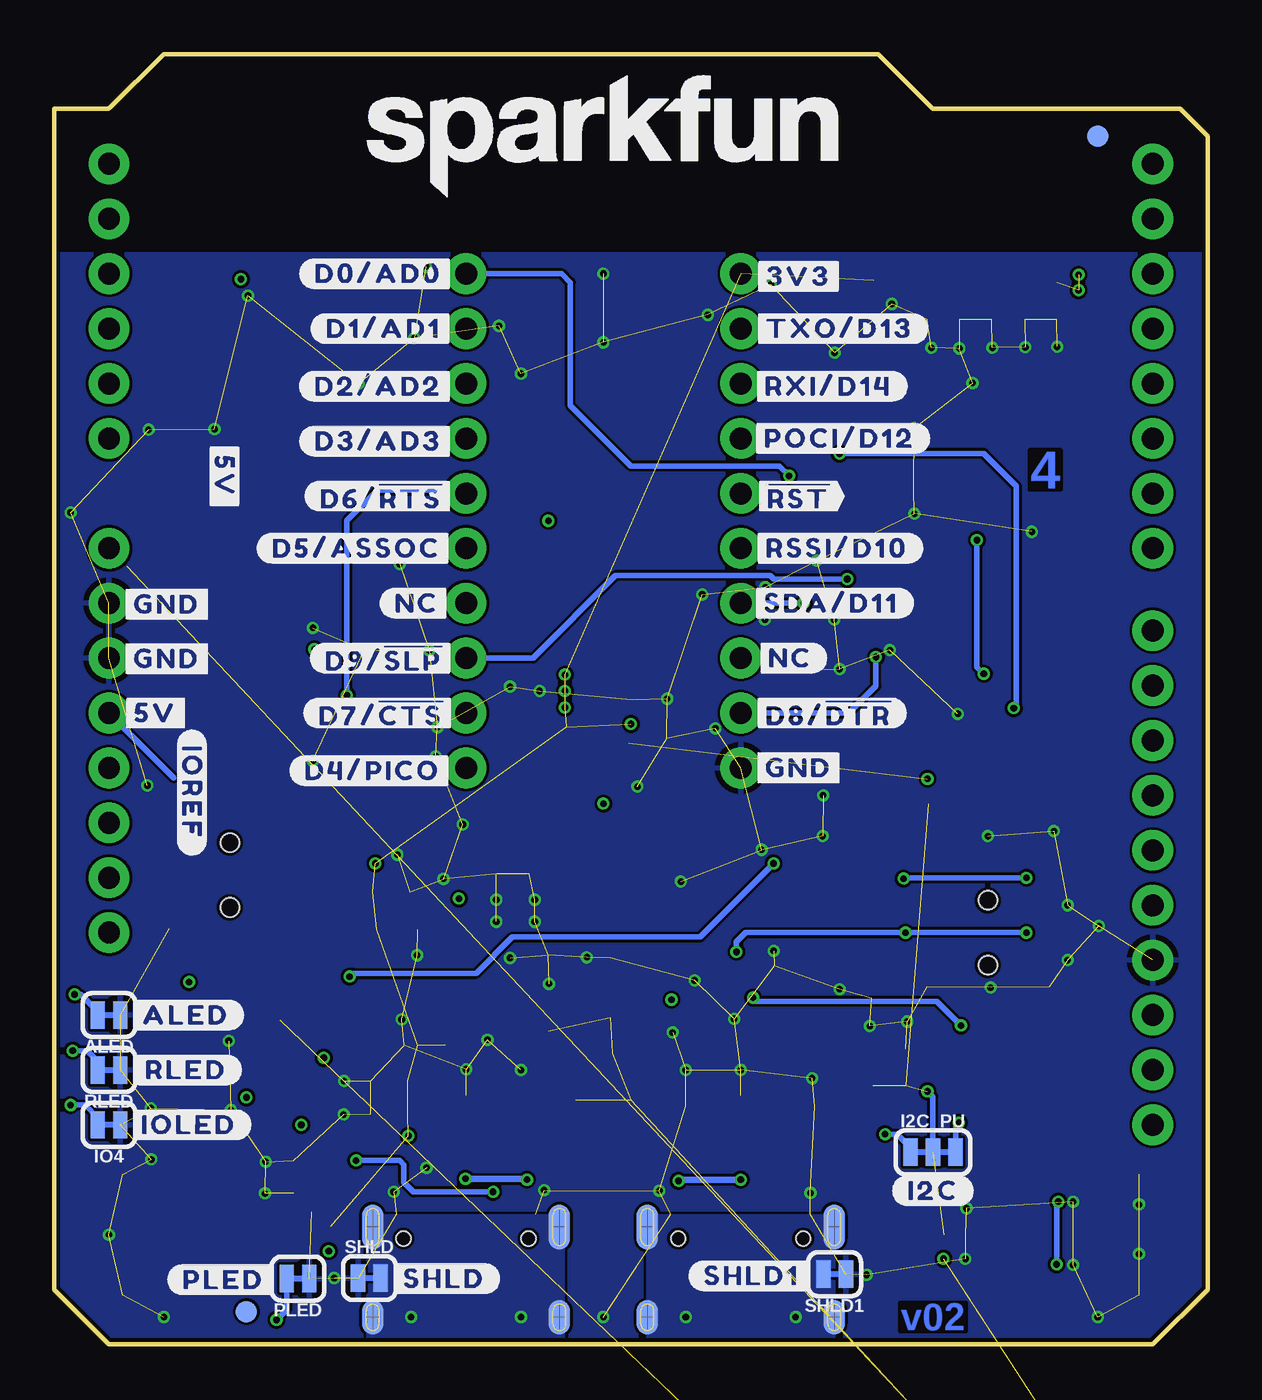
[diagram p4: board, bottom side, seen from below]

Size 53.34 x 59.69 mm. Coordinates in mm from the lower left corner, seen from the top.
Outline: 0,55.88 0,2.54 2.54,0 50.8,0 53.34,2.54 53.34,57.15 50.8,57.15 48.26,59.69 15.24,59.69 12.7,57.15 1.27,57.15 0,55.88
Copper layers (1*2*15*16): Top 0.035559375mm / dielectric 0.47751875mm / Route2 0.035559375mm / dielectric 0.47751875mm / Route15 0.035559375mm / dielectric 0.47751875mm / Bottom 0.035559375mm
Design rules "SparkFun-4-Layer-Minimum-JLCPCB": minimum track width 5mil, minimum drill 0.2mm, track to track 5mil, track to pad 5mil, pad to pad 5mil, via to via 5mil, smd to smd 5mil, copper to edge 7mil, drill to drill 7mil, minimum pad ring 5mil, minimum via ring 5mil, stop-mask expansion 2.5mil, vias tented up to drill 25mil, thermal gap 10mil
tRestrict: area 30.2,20.9 to 30.6,22; area 25.5,21.3 to 25.9,22.5; area 11,36.4 to 11.2,36.9

### Footprints (pad centres in the part's own frame; a part is rotated, then mirrored left to right if it is on the bottom)
SMT-JUMPER_2_NC_TRACE_SILK = smd 0.66 x 1.27: 1 -0.521,0; 2 0.521,0
UNO_R3_SHIELD_NOLABELS = drill 1.016 pad 1.88: 3.3V 24.13,-3.81; 5V 24.13,-1.27; A0 24.13,11.43; A1 24.13,13.97; A2 24.13,16.51; A3 24.13,19.05; A4 24.13,21.59; A5 24.13,24.13; AREF -24.13,-15.24; D2 -24.13,19.05; D3 -24.13,16.51; D4 -24.13,13.97; D5 -24.13,11.43; D6 -24.13,8.89; D7 -24.13,6.35; D8 -24.13,2.54; D9 -24.13,0; D10 -24.13,-2.54; D11 -24.13,-5.08; D12 -24.13,-7.62; D13 -24.13,-10.16; GND@0 24.13,1.27; GND@1 24.13,3.81; GND@2 -24.13,-12.7; IOREF 24.13,-8.89; NC 24.13,-11.43; RES 24.13,-6.35; RX -24.13,24.13; SCL -24.13,-20.32; SDA -24.13,-17.78; TX -24.13,21.59; VIN 24.13,6.35
1210 = smd 1.27 x 2.06: 1 -1.755,0; 2 1.755,0
0603 = smd 1.1 x 1: 1 -0.85,0; 2 0.85,0
SOD-323 = smd 0.63 x 0.83: A 1.15,0; C -1.15,0
LED-0603 = smd 1 x 1: A -0.877,0; C 0.877,0
SMA-DIODE = smd 1.27 x 1.47: A -2.15,0; C 2.15,0
USB-C-16P-4LAYER-ISOLATED = smd 0.3 x 1: A5 -1.25,-0.34; A6 -0.25,-0.34; A7 0.25,-0.34; A8 1.25,-0.34; B5 1.75,-0.34; B6 0.75,-0.34; B7 -0.75,-0.34; B8 -1.75,-0.34 | smd 0.6 x 1: GND -3.225,-0.34; GND2 3.225,-0.34; VBUS1 -2.45,-0.34; VBUS2 2.45,-0.34 | smd 1 x 2.1: SHLD1 -4.32,-0.915; SHLD2 4.32,-0.915 | smd 1 x 2.1 bottom: SHLD3 -4.32,-0.915; SHLD4 4.32,-0.915 | smd 1 x 1.6: SHLD5 -4.32,-5.095; SHLD8 4.32,-5.095 | smd 1 x 1.6 bottom: SHLD6 -4.32,-5.095; SHLD7 4.32,-5.095 | hole 0.65: -2.89,-1.445; 2.89,-1.445
FIDUCIAL-1X2 = smd 1 x 1: 1 0,0
SMT-JUMPER_3_2-NC_TRACE_SILK = smd 0.66 x 1.27: 1 -1.041,0; 2 0,0; 3 1.041,0
XBEE3-SMD = smd 1.7 x 0.85: 1 -12.5,11.11; 2 -9.5,9.11; 3 -12.5,7.11; 4 -9.5,5.11; 5 -12.5,3.11; 6 -9.5,1.11; 7 -12.5,-0.89; 8 -9.5,-2.89; 9 -12.5,-4.89; 10 -9.5,-6.89; 11 12.5,-6.89; 12 9.5,-4.89; 13 12.5,-2.89; 14 9.5,-0.89; 15 12.5,1.11; 16 9.5,3.11; 17 12.5,5.11; 18 9.5,7.11; 19 12.5,9.11; 20 9.5,11.11
JST04_1MM_RA = smd 0.6 x 1.35: 1 -1.5,0; 2 -0.5,0; 3 0.5,0; 4 1.5,0 | smd 1.2 x 2: NC1 2.8,-3.675; NC2 -2.8,-3.675
1X10_NO_SILK = drill 1.016 pad 1.88: 1 0,0; 2 2.54,0; 3 5.08,0; 4 7.62,0; 5 10.16,0; 6 12.7,0; 7 15.24,0; 8 17.78,0; 9 20.32,0; 10 22.86,0
SMT-JUMPER_2_NO_SILK = smd 0.635 x 1.27: 1 -0.406,0; 2 0.406,0
INDUCTOR_3.9UH = smd 4 x 1.6: P$1 0,-2; P$2 0,1.9
SOT23-3 = smd 0.8 x 0.9: 1 -0.95,-1; 2 0.95,-1; 3 0,1.1
SOT363_PHILIPS = smd 0.4 x 0.8: 1 -0.65,-0.8; 2 0,-0.8; 3 0.65,-0.8; 4 0.65,0.8; 5 0,0.8; 6 -0.65,0.8
TACTILE_SWITCH_SMD_5.2MM = smd 1.524 x 0.762: 1 -2.794,1.905; 2 2.794,1.905; 3 -2.794,-1.905; 4 2.794,-1.905
SWITCH_DPDT_SMD_AYZ0202 = smd 1 x 1.15: 1 -2.5,2.825; 2 0,2.825; 3 2.5,2.825; 4 -2.5,-2.825; 5 0,-2.825; 6 2.5,-2.825 | hole 0.85: 1.5,0; -1.5,0
MSOP10 = smd 1 x 0.3: 1 -2.25,1; 2 -2.25,0.5; 3 -2.25,0; 4 -2.25,-0.5; 5 -2.25,-1; 6 2.25,-1; 7 2.25,-0.5; 8 2.25,0; 9 2.25,0.5; 10 2.25,1
SOT23-6 = smd 0.55 x 1.35: 1 -0.95,-1.375; 2 0,-1.375; 3 0.95,-1.375; 4 0.95,1.375; 5 0,1.375; 6 -0.95,1.375
SOT-23-6 = smd 0.55 x 1.35: 1 -0.95,-1.375; 2 0,-1.375; 3 0.95,-1.375; 4 0.95,1.375; 5 0,1.375; 6 -0.95,1.375
SSOP20_L = smd 0.381 x 1.143: 1 -2.857,-2.68; 2 -2.223,-2.68; 3 -1.587,-2.68; 4 -0.953,-2.68; 5 -0.318,-2.68; 6 0.318,-2.68; 7 0.953,-2.68; 8 1.587,-2.68; 9 2.223,-2.68; 10 2.857,-2.68; 11 2.857,2.68; 12 2.223,2.68; 13 1.587,2.68; 14 0.953,2.68; 15 0.318,2.68; 16 -0.318,2.68; 17 -0.953,2.68; 18 -1.587,2.68; 19 -2.223,2.68; 20 -2.857,2.68

### Placement (x,y rotation side)
ALED  50.8,15.24 180 bottom
B1  26.67,30.48 0 top
C1  30.48,16.26 90 top
C2  32.89,22.61 270 top
C3  24.26,18.8 90 top
C4  31.37,22.61 270 top
C5  6.99,48.26 270 top
C6  13.59,40.39 270 top
C7  9.98,48.26 270 top
C8  8.46,48.26 270 top
C9  11.48,48.26 270 top
C10  12.95,48.26 270 top
C11  37.85,12.19 0 top
C12  37.74,20.93 180 top
C13  13.97,12.83 90 top
C14  37.85,10.67 0 top
D1  26.67,10.16 270 top
D2  42.04,2.54 270 top
D3  50.8,15.24 0 top
D4  50.8,12.7 0 top
D5  29.21,10.16 270 top
D6  50.8,10.16 0 top
D7  -27.94,-54.61 0 top  (outside the outline)
DIRECT_USB  21.59,6.35 0 top
FD1  5.08,55.88 0 top
FD2  5.08,55.88 0 bottom
FD3  44.45,1.52 0 top
FD4  44.45,1.52 0 bottom
FRAME1  -10.16,-36.83 0 top  (outside the outline)
I2C_PU  12.7,8.89 0 bottom
IO4  50.8,10.16 180 bottom
J2  27.94,38.1 0 top
J4  12.7,5.08 0 top
J5  34.29,49.53 270 top
J6  21.59,49.53 270 top
JP1  -34.29,-54.61 0 top  (outside the outline)
L1  27.94,21.84 0 top
LOGO1  -30.48,-38.1 0 top  (outside the outline)
LOGO2  46.61,57.28 0 top
LOGO3  12.7,6.48 0 top
LOGO4  58,56.5 0 top  (outside the outline)
PLED  42.06,3.05 180 bottom
Q3  42.93,16.13 180 top
Q5  30.61,27.56 180 top
Q7  27.56,27.18 90 top
R1  12.93,24.16 270 top
R2  47.04,11.68 0 top
R3  26.67,13.46 0 top
R4  15.49,12.83 270 top
R6  25.02,27.18 270 top
R7  41.4,8.51 180 top
R8  41.4,6.99 180 top
R10  47.04,10.16 0 top
R11  41.4,5.46 0 top
R12  47.04,13.26 0 top
R13  18.16,10.16 270 top
R14  12.45,8.89 90 top
R15  13.97,8.89 90 top
R16  24.13,10.16 270 top
R17  27.46,29.84 0 top
RLED  50.8,12.7 180 bottom
S1  5.08,5.08 270 top
S2  48.26,5.08 90 top
S3  10.16,19.05 270 top
S5  45.21,21.72 90 top
SHLD  38.76,3.07 0 bottom
SHLD1  17.25,3.25 180 bottom
U1  17.78,16.51 180 top
U2  26.67,16.51 0 top
U3  21.59,10.16 180 top
U4  36.83,16.51 180 top
U5  34.29,10.16 180 top
U$1  [RSSI31]  50.8,13.97 0 top
U$2  [PWR29]  40.13,2.54 90 top
U$3  [#SDA#10]  5.08,12.7 0 top
U$4  [#SHLD#36]  35.31,3.05 0 bottom
U$5  [#NC#1]  19.3,31.75 0 bottom
U$6  [#D3#AD3#23]  38.35,41.78 0 bottom
U$7  [#NC#3]  36.58,34.29 0 bottom
U$8  [##DTR##27]  18.97,29.13 0 top
U$9  [#NC#1]  23.88,31.75 0 top
U$10  [#NC#3]  32.13,34.29 0 top
U$11  [#D1#AD1#8]  38.1,46.99 0 bottom
U$12  [##CTS##28]  36.98,29.06 0 top
U$13  [#D8##DTR##27]  17.53,29.21 0 bottom
U$14  [#RSSI#D10#17]  17.14,36.83 0 bottom
U$15  [#SDA#D11#9]  17.4,34.29 0 bottom
U$16  [##RST##15]  18.92,39.24 0 bottom
U$17  [#POCI#D12#24]  17.02,41.91 0 bottom
U$18  [#RXI#D14#15]  17.53,44.32 0 bottom
U$19  [#D2#AD2#19]  38.35,44.32 0 bottom
U$20  [#D6##RTS##25]  38.23,39.24 0 bottom
U$21  [#TXO#8]  24.51,46.99 0 top
U$22  [#TXO#D13#13]  17.02,46.99 0 bottom
U$23  [#D0#AD0#18]  46.74,54.61 0 top
U$24  [#SCL#7]  5.08,10.16 0 top
U$25  [#GND#0]  5.21,17.78 0 top
U$26  [#I2C#33]  12.7,7.11 0 bottom
U$27  [#RXI#7]  24.1,44.42 0 top
U$28  [UART34]  34.29,7.37 0 top
U$29  [#GND#0]  48.13,31.72 0 bottom
U$30  [#RST#30]  1.27,5.08 90 top
U$31  [#PICO#26]  34.32,23.85 90 top
U$32  [#TXO#8]  5.33,54.61 0 top
U$33  [#RXI#7]  4.93,52.04 0 top
U$34  [#RSSI#D10#17]  46.35,52.07 0 top
U$35  [#D5#ASSOC#25]  39.37,36.83 0 bottom
U$36  [#D9##SLP##28]  38.1,31.75 0 bottom
U$37  [#D7##CTS##26]  38.23,29.21 0 bottom
U$38  [#D4#PICO#25]  38.61,26.54 0 bottom
U$39  [#5V#5]  48.64,29.21 0 bottom
U$40  [D03]  44.45,5.08 90 top
U$41  [#GND#0]  48.13,34.24 0 bottom
U$42  [#5V#5]  45.47,40.16 270 bottom
U$43  [##CS##19]  4.7,27.94 0 top
U$44  [#3V3#1]  45.21,17.4 0 top
U$45  [#POCI#32]  24.51,41.91 0 top
U$46  [#PICO#24]  5.46,22.86 0 top
U$47  [#3V3#1]  24.26,49.53 0 top
U$48  [#EN#17]  4.7,30.48 0 top
U$49  [#ALED#21]  47.24,15.24 0 bottom
U$50  [#GND#0]  18.9,26.67 0 top
U$51  [#RLED#22]  47.24,12.7 0 bottom
U$52  [#PLED#20]  45.52,3 0 bottom
U$53  [#POCI#23]  5.46,25.4 0 top
U$54  [##RST##13]  24.13,39.37 0 top
U$55  [#RSSI#16]  24.38,36.83 0 top
U$56  [#SDA#10]  24.26,34.29 0 top
U$57  [#ASSOC#28]  30.61,36.83 0 top
U$58  [##RTS##14]  31.62,39.37 0 top
U$59  [##CS##26]  32.13,41.78 0 top
U$60  [#SCLK#33]  31.24,44.32 0 top
U$61  [SFE_LOGO_FLAME_.2]  10.29,53.59 0 top
U$62  [SFE_LOGO_NAME_.2]  27.94,55.88 0 bottom
U$63  [#SCLK#18]  5.59,20.32 0 top
U$64  [#SCL#9]  31.75,46.99 0 top
U$65  [#D0#3]  32.13,49.53 0 top
U$66  [OEB59315]  5.05,46.86 0 top
U$67  [R310]  42.06,22.96 0 top
U$68  [##SLP##28]  31.75,31.75 0 top
U$69  [OFF311]  41.78,20.37 0 top
U$70  [VIN8]  41.83,29.82 0 top
U$71  [DIRECT_USB33]  21.59,7.37 0 top
U$72  [#DUSB#31]  14.22,20.3 0 top
U$73  [#I2C#13751]  13.41,17.79 0 top
U$74  [ASC32]  50.8,16.76 0 top
U$75  [#SHLD1#37]  21.08,3.17 0 bottom
U$76  [#GND#0]  18.92,26.67 0 bottom
U$77  [#3V3#1]  18.92,49.4 0 bottom
U$78  [#D0#AD0#18]  38.35,49.53 0 bottom
U$79  [ARDUINO1345]  24.13,53.34 0 top
U$80  [XBEE340]  17.78,55.88 0 top
U$81  [SHIELD1346]  31.75,53.34 0 top
U$82  [#D6#27]  48.77,49.53 0 top
U$83  [D727]  48.59,41.43 0 top
U$84  [#D8#27]  4.7,49.53 0 top
U$85  [DEVELOPMENT1346]  27.94,55.88 0 top
U$86  [BOARD1347]  38.1,55.88 0 top
U$87  [XB9]  42.04,33.91 0 top
U$88  [#VIN#4]  45.21,35.69 0 top
U$89  [#IOREF#35]  46.96,25.53 270 bottom
U$90  [#OEIO#59314]  5.51,44.4 0 top
U$91  [D59313]  48.69,46.96 0 top
U$92  [D9312]  48.59,44.37 0 top
U$93  [#IOLED#5]  47.12,10.16 0 bottom
U$94  [IO49]  50.88,11.35 0 top
UART  34.29,6.35 0 top

### Tracks (layer width: path | path; a pad name or v marks a point on that pad's centre or on a via)
3.3V  (via drill 0.3)  (24 unrouted)
  Top 0.254: R1.1 12.93,26.14 v12.95,26.16 | R11.1 40.55,4.32 v40.64,4.32 | Q7.4 26.3,27.83 26.05,28.08 26.05,28.46 26.29,28.7 v26.67,28.7
  Top 0.762: J2.1 15.41,49.24 13.08,49.24 C10.1 C9.1 C7.1 8.66,49.11 8.56,49.21 C8.1 C5.1 | J4.2 12.2,3.98 v12.22,3.96
  Bottom 0.254: I2C_PU.2 12.7,11.46 v12.95,11.71
  other vias: 38.48,22.25 5.97,49.48 5.97,48.77 29.72,29.46 29.72,30.23 29.72,30.99 36.96,9.65
  pour Route15 (isolate 0.127, rank 3): 0,0 53.34,0 53.34,50.42 0,50.42
  pour Top (no thermals): 13.97,49.81 5.64,49.81 5.64,48.44 13.97,48.44
  pour Top (isolate 0.305, no thermals): 12.45,12.57 16.26,12.57 16.26,11.18 12.45,11.18
  pour Top (no thermals): 29.08,28.19 30.35,28.19 30.35,31.37 29.08,31.37
  pour Top (no thermals): 36.32,9.14 37.59,9.14 37.59,12.95 36.75,12.95 36.75,15.11 35.05,15.11 35.05,13.21 35.43,13.21 35.43,14.48 35.69,14.48 35.69,13.21 36.07,13.21 36.07,14.48 36.32,14.48
  pour Top (no thermals): 38.23,18.67 38.23,20.19 38.1,20.32 38.1,22.73 39.14,22.73 39.14,20.73 38.61,20.19 38.61,18.67
3.3V_VREG  (via drill 0.3)
  Top 0.254: U2.1 25.72,15.45 25.22,15.95 v24.79,15.95
  Route2 0.254: v24.79,15.95 27.08,15.95 27.94,16.82 v27.94,25.02
  pour Top (no thermals): 25.91,24.13 25.91,22.86 33.43,22.86 33.43,24.23 30.86,26.8 27.94,26.8 27.94,26.16
3V3_R3
  Top 0.762: Q3.2 41.98,17.59 41.1,18.47 41.1,23.19 42.12,24.22 S5.3 S5.6 48.6,24.22 49.66,25.27 50.8,26.42 B1.3.3V
5V
  Bottom 0.254: B1.5V 47.8,26.21
!RESET!  (via drill 0.3)
  Top 0.254: J6.5 19.75,41.21 v17.02,41.21 J2.5 13.62,41.21 C6.1 | v8.97,29.44 9.02,29.39 9.02,10.19 6.99,8.15 S1.1 6.91,7.8 v6.91,6.6 | v6.99,3.71 S1.2
  Bottom 0.254: v8.97,29.44 8.84,29.57 8.84,39.7 10.35,41.21 v17.02,41.21 | v6.91,6.6 6.99,6.53 v6.99,3.71
D0  (via drill 0.3)
  Top 0.254: J5.1 35.56,49.53 35.88,49.21 J2.20 44.63,49.21 v44.7,49.28 | S2.1 S2.2 46.35,8.81 46.99,9.45 46.99,11.08 47.07,11.15 47.07,16.74 v47.09,16.76 | 12.09,34.04 14.12,36.07 14.12,38 16.31,40.18 v19.36,40.18
  Route2 0.254: v47.09,16.76 47.09,47.38 45.25,49.23 45.26,49.23 45.21,49.28 v44.7,49.28
  Bottom 0.254: v19.36,40.18 19.81,40.64 26.67,40.64 29.46,43.43 29.46,49.12 29.87,49.53 J5.1
D0-TRANS
  Top 0.254: B1.D12 3.66,22.86 4.27,23.47 4.27,32.77 5.54,34.04
D1/SCL  (via drill 0.3)
  Top 0.254: J2.19 34.51,47.21 J5.2 33.02,48.26 15.7,48.26 10.67,43.23 v10.67,37.21 | 9.64,31.74 v10.35,31.03 10.42,30.96 10.42,26.89 11.51,25.81 11.51,16.28 9.86,14.63 9.86,4.04 10.64,3.25 13.26,3.25 14.2,4.19 J4.4 14.2,7.81 R15.1
  Bottom 0.254: v10.35,31.03 10.67,31.34 v10.67,37.21
D1/SCL-TRANS
  Top 0.254: B1.SCL 5.71,13.34 5.71,21.46 8.14,23.89
D2/SPI_CLK
  Top 0.254: J2.18 35.05,45.21 J5.3
D3/SPI_!CS!
  Top 0.254: J2.17 40.01,43.21 39.53,42.73 36.63,42.73 35.81,41.91 J5.4
D4/SPI_PICO  (via drill 0.3)
  Top 0.254: J5.10 36.7,26.67 36.96,26.92 36.96,30.91 37.26,31.21 J2.11 40.79,31.21 41.3,31.73 v41.3,32.16 | R10.1 v41.91,10.16
  Route2 0.254: v41.3,32.16 41.91,31.55 v41.91,10.16
D5/ASSOCIATE  (via drill 0.3)
  Top 0.254: J2.15 36.67,39.21 J5.6 | R12.1 46.12,13.18 40.95,13.18 v40.87,13.26
  Route2 0.254: v40.87,13.26 40.64,13.49 40.64,36.25 40.06,36.83 J5.6
D6/!RTS!  (via drill 0.3)
  Top 0.254: J2.16 36.13,41.21 J5.5 | U4.2 39.05,19.98 39.4,20.32 39.4,23.6 39.26,23.74 39.26,29.12 39.8,29.67 v39.8,30.02
  Bottom 0.254: J5.5 34.44,39.52 38.38,39.52 39.8,38.1 v39.8,30.02
D7/!CTS!  (via drill 0.3)
  Top 0.254: J5.9 37.44,32.36 J2.12 | U4.9 34.61,20.61 v34.62,20.62
  Route2 0.254: J5.9 35.94,29.21 36.6,28.55 36.6,24.59 34.62,22.61 v34.62,20.62
D8/!DTR!  (via drill 0.3)
  Top 0.254: J2.9 15.34,33.11 v15.34,31.8 | U4.1 39.69,17.03 v39.67,17.02 | J6.9 21.59,28.61 20.07,27.09 v20.07,22.25
  Bottom 0.254: J6.9 16.59,29.21 15.34,30.45 v15.34,31.8 | v39.67,17.02 39.52,17.17 33.83,17.17 32.15,18.85 23.47,18.85 v20.07,22.25
D9/!SLEEP!  (via drill 0.3)
  Top 0.254: J5.8 35.87,33.33 35.87,34.82 36.25,35.21 J2.13 | 12.76,33.54 14.63,35.41 v16.66,35.41
  Bottom 0.254: v16.66,35.41 20.07,35.41 20.23,35.56 27.38,35.56 31.19,31.75 J5.8
D9/!SLEEP!-TRANS
  Top 0.254: B1.D13 5.18,22.96 5.18,32.53 6.19,33.54
D10/RSSI_PWM  (via drill 0.3)
  Top 0.254: J2.6 18.95,39.21 21.33,36.83 J6.6 28.4,36.83 29.67,38.1 v30.48,38.1 | R2.1 45.94,11.43 v44.45,11.43
  Route2 0.254: v30.48,38.1 44.04,38.1 44.45,37.69 v44.45,11.43
D11/SDA  (via drill 0.3)
  Top 0.254: J4.3 13.2,7.29 R14.1 10.67,9.82 10.67,14.07 11.35,14.76 v11.4,14.76 | v18.67,34.29 14.38,34.29 13.13,33.04 | J6.7 22.73,34.29 23.37,33.66 23.37,26.04 21.16,23.82 21.16,16.19 v21.02,16.04 20.98,16.01 U1.2
  Bottom 0.254: J6.7 v18.67,34.29 | v11.4,14.76 12.52,15.88 20.85,15.88 v21.02,16.04
D11/SDA-TRANS
  Top 0.254: B1.SDA 4.45,14.61 4.45,21.23 6.02,22.81 6.02,32.42 6.64,33.04
D12/SPI_POCI
  Top 0.254: J6.4 20.29,43.21 J2.4
D13/TXO
  Top 0.254: 11.32,36.04 11.58,36.3 11.58,43.1 15.69,47.21 J2.2 21.37,47.21 J6.2 31.88,46.99 32.84,46.02 32.84,26.43 37.78,21.49 U4.4
D13/TXO-TRANS
  Top 0.254: B1.RX 3.94,54.61 4.9,53.65 4.9,37.72 6.58,36.04
D14/RXI
  Top 0.254: 11.81,35.54 12.57,36.3 12.57,42.8 14.98,45.21 J2.3 20.83,45.21 J6.3 30.99,44.45 31.57,43.87 31.57,29.92 32.28,29.21 32.28,26.06 33.91,24.43 33.91,20.6 33.5,20.19 33.5,18.06 34.65,16.92 38.33,16.92 39.69,15.56 U4.20
D14/RXI-TRANS
  Top 0.254: 5.48,35.54 4.14,36.88 4.14,51.49 3.56,52.07 B1.TX
D+
  Top 0.203: UART.A6 34.04,5.1 34.27,4.87 34.76,4.87 35.04,5.15 UART.B6 35.04,7.61 35.24,7.81 U5.6 35.24,9.14 34.48,9.91 33.14,9.91 32.74,10.31 32.74,14.71 32.91,14.88 33.78,14.88 33.97,14.69 U4.11
D-
  Top 0.203: 33.57,6.83 33.57,7.76 33.34,7.99 U5.4 33.34,9.21 32.38,10.16 32.38,14.86 32.77,15.24 33.96,15.24 34.59,14.61 34.59,13.84 U4.12 | 33.57,6.83 33.57,6.04 UART.B7 | 33.57,6.83 34.34,6.83 34.54,6.62 UART.A7
DIRECT_D+
  Top 0.203: DIRECT_USB.A6 21.34,5.46 21.59,5.21 22.1,5.21 22.34,5.45 DIRECT_USB.B6 22.34,7.61 22.54,7.81 U3.6 22.54,9.19 21.69,10.03 20.32,10.03 19.66,10.69 19.66,13.61 18.57,14.7 18.57,15.74 19.34,16.51 U1.3
DIRECT_D-
  Top 0.203: 20.87,7.04 20.87,6.04 DIRECT_USB.B7 | 20.87,7.04 20.87,7.79 20.64,8.02 U3.4 20.64,9.21 19.3,10.54 19.3,13.46 18.19,14.57 18.19,16.6 17.78,17.01 U1.7 | DIRECT_USB.A7 21.84,6.74 21.54,7.04 20.87,7.04
DIRECT_SELECT  (via drill 0.3)
  Top 0.254: U1.1 21.38,15.51 21.79,15.93 v21.79,18.16 | S3.2 v13.97,19.05 | v8.38,19.05 S3.5
  Bottom 0.254: v21.79,18.16 21.79,18.62 21.36,19.05 v13.97,19.05 v8.38,19.05
DIRECT_USB  (via drill 0.3)
  Top 0.203: S3.4 7.38,21.59
  Top 0.254: R1.2 12.93,21.55 S3.1 v14.06,21.55 | 7.38,21.59 v8.38,21.59
  Bottom 0.254: v8.38,21.59 14.02,21.59 v14.06,21.55
EN
  Top 0.254: R3.1 26.67,14.31 U2.2
GATE
  pour Top (no thermals): 47.96,40.56 47.96,41.25 47.83,41.38 42.49,41.38 42.49,40.56
GND  (via drill 0.3)  (152 unrouted)
  Top 0.254: U4.6 36.51,20.55 C12.2 | R8.1 41.41,6.15 | S5.4 46.2,19.22 | 46.2,19.22 S5.1 | 46.19,19.2 46.2,19.22
  other vias: 31.11,19.56 32.89,19.56 17.02,31.24 28.7,17.91 39.93,12.19 8.43,46.13 9.96,46.1 11.48,46.08 15.77,3.23 11.2,3.96 11.15,6.3 17.25,45.87 27.94,49.53 48.26,1.27 40.39,3.07 27.94,1.27 5.08,1.27 24.74,14.43 20.07,18.21 21.89,15.06 31.75,12.7 24.13,12.7 21.59,12.7 18.29,12.32 3.17,4.19 18.36,7.01 50.8,5.08 13.89,14.94 6.96,46.15 31.11,20.57 32.89,20.57 12.78,46.1 18.08,36.26 34.44,24.05 48.84,8.56 23.72,16.84 24.36,21.41 20.62,22.89 20.19,49.02 39.24,44.45 37.36,36.09 38.99,32.13 8.13,37.59 27.94,46.35 52.58,38.48 23.11,47.62 17.27,33.53 14.7,32.12 7.11,23.75 5.03,19.35 6.48,20.32 6.48,17.78 15.62,14.73 14.61,48.13 41.38,33.15 35.99,32.11 39.95,10.64 36.14,49.86 30.68,7.14 25.35,7.11 10.03,16.51 10.16,23.52 22.76,28.5 20.47,33.53 20.45,35.03 31.75,44.91 35.61,28.55 35.69,27.2 17.81,23.52 17.78,25.4 3.17,6.48 6.22,6.6 6.22,3.68 17.02,16.43 11.55,29.17 37.64,7.06 32.26,30.43 37.47,22.66 34.29,12.73 36.12,8.18 37.26,15.04 43.56,8.46 43.59,6.99 30.45,16.69 32.26,17.88 24.99,29.87 48.97,42.32 33.3,14.1 36.55,18.01 45.26,14.05 45.16,10.85 48.87,10.92 49.02,25.86 41.38,27 10.87,44.48 45.92,42.34 44.37,48.51 13.56,42.39 26.37,25.81 30.89,30.23 23.37,34.7 32.77,47.12 36.68,46.56 35.33,21.54 13.56,38.43
  pour Top (isolate 0.127, rank 3): 0,0 53.34,0 53.34,50.42 0,50.42
  pour Bottom (isolate 0.127, rank 3): 0,0 53.34,0 53.34,50.42 0,50.42
  pour Route2 (isolate 0.127, rank 3): 0,0 53.34,0 53.34,50.42 0,50.42
  pour Top (no thermals): 42.24,8.43 42.24,6.99 41.86,6.99 41.35,7.49 41.35,7.98 41.81,8.43 42.21,8.43
N$1
  Top 0.254: U2.6 24.45,17.89 24.39,17.95 C3.1
N$2
  Top 0.254: R2.2 48.91,11.68 49.09,11.87 D4.A
N$3  (via drill 0.3)
  Top 0.254: D4.C 51.68,12.79 v52.48,13.59
  Bottom 0.254: v52.48,13.59 51.82,13.59 51.32,13.09 RLED.2
N$4
  Top 0.254: R10.2 D6.A
N$5
  Top 0.254: UART.B5 36.04,7.08 36.58,7.62 38.89,7.62 39.52,6.99 R8.2
N$6  (via drill 0.3)
  Top 0.254: UART.A5 v33.04,7.06 | v39.37,8.51 R7.2
  Bottom 0.254: v33.04,7.06 36.73,7.06 37.16,7.49 37.16,8.31 37.36,8.51 38.1,8.51 v39.37,8.51
N$7
  Top 0.254: D2.A 42.04,5.25 R11.2
N$8
  pour Top (isolate 0.305, no thermals): 27.05,17.27 27.05,19.02 30.23,19.02 30.23,20.57 23.62,20.57 23.62,19.08 26.29,19.08 26.29,17.27
N$10
  Top 0.254: R4.1 14.73,14.44 14.73,15.24 15,15.51 U1.10
N$11  (via drill 0.3)
  Top 0.254: R14.2 11.92,10.26 v11.51,10.26
  Bottom 0.254: v11.51,10.26 11.66,10.11 I2C_PU.3
N$12
  Top 0.254: R12.2 47.98,13.26 49.92,15.2 D3.A
N$13  (via drill 0.3)
  Top 0.254: R15.2 13.98,9.73 v14.91,9.73
  Bottom 0.254: I2C_PU.1 13.74,9.12 14.35,9.73 v14.91,9.73
N$14
  Top 0.254: DIRECT_USB.B5 23.34,7.63 24.13,8.42 R16.2
N$15
  Top 0.254: DIRECT_USB.A5 20.34,7.6 19.24,8.7 18.77,8.7 R13.2
N$16  (1 unrouted)
  Top 0.762: 42.9,15 Q3.3
N$17  (via drill 0.3)
  Top 0.254: D6.C 51.68,10.17 v52.58,11.07
  Bottom 0.254: IO4.2 51.32,10.49 51.91,11.07 v52.58,11.07
N$19
  Top 0.254: Q7.6 25.91,26.53 | 25.91,26.53 25.22,26.53 R6.2 | 25.91,26.53 25.91,27.05 26.04,27.18 Q7.5 Q7.2
N$20
  Top 0.254: Q5.1 30.83,27.83 29.21,27.83 29.2,27.83 Q7.3 27.93,27.83 27.56,28.19 27.56,29.1 R17.2
N$21  (via drill 0.3)
  Top 0.254: v52.39,16.19 52.39,15.95 D3.C
  Bottom 0.254: v52.39,16.19 52.09,16.19 51.32,15.42 ALED.2
N$23  (via drill 0.3)
  Top 0.254: D2.C 42.56,1.14 v43.05,1.14
  Bottom 0.254: PLED.2 42.58,1.61 v43.05,1.14
N$27
  Top 0.254: S5.2 S5.5 49.4,20.35 49.4,18.59 48.74,17.93 44.68,17.93 Q3.1
SHLD  (via drill 0.3)
  other vias: 31.75,1.27 36.83,1.27
  pour Top (rank 2, no thermals): 29.77,5.97 38.86,5.97 38.86,0 29.77,0
  pour Bottom (rank 2, no thermals): 38.86,5.97 29.77,5.97 29.77,0 38.86,0
SHLD1  (via drill 0.3)
  other vias: 19.05,1.27 24.13,1.27
  pour Top (rank 2, no thermals): 17.27,5.97 25.91,5.97 25.91,0 17.27,0
  pour Bottom (rank 2, no thermals): 25.91,5.97 17.27,5.97 17.27,0 25.91,0
SOURCE
  pour Top (no thermals): 48.03,38.46 48.03,38.99 47.75,39.27 42.57,39.27 42.57,38.46
V_USB  (via drill 0.3)
  Top 0.203: U5.5 34.31,8.76 v34.31,7.67 | 31.84,7.19 UART.VBUS1
  Top 0.762: D5.A 30.09,9.01 30.35,8.76 v31.47,7.63 v31.47,7.62 31.84,7.25 31.84,7.19
  Bottom 0.203: 31.52,7.67 v31.47,7.62
  Bottom 0.305: v34.31,7.67 31.52,7.67
  pour Top (no thermals): 31.62,7.37 31.62,5.33 33.15,3.81 35.69,3.81 36.96,5.08 36.96,6.48 36.58,6.48 36.58,5.71 36.45,5.59 32.13,5.59 32.13,7.37
V_USB_2  (via drill 0.3)
  Top 0.203: U3.5 v21.59,7.62 | v24.46,7.57 24.04,7.15 24.04,7.08 24.13,6.99
  Top 0.762: D1.A 25.92,9.01 25.6,8.69 24.13,7.22 24.13,6.99
  Bottom 0.203: 24.41,7.62 v24.46,7.57
  Bottom 0.305: v21.59,7.62 24.41,7.62
  pour Top (no thermals): 18.92,6.48 18.92,5.33 20.45,3.81 22.99,3.81 24.26,5.08 24.26,6.99 23.88,6.99 23.88,5.71 23.75,5.59 19.43,5.59 19.43,6.48
VIN  (5 unrouted)
  pour Top (no thermals): 26.29,10.92 29.72,10.92 29.72,13.59 31.57,13.59 31.57,15.75 27.43,15.75 27.43,14.1 26.92,14.1 26.92,12.83 26.8,12.7 26.29,12.7
VIN_R3  (1 unrouted)
  Top 0.762: 49.74,39.08 50.8,38.02 B1.VIN 49.97,36
XBEE_D+/SDA
  Top 0.203: J2.7 18.11,37.21 19.91,35.41 19.91,30.45 18.9,29.44 18.9,17.55 19.42,17.03 20.01,17.03 U1.4
XBEE_D-
  Top 0.203: U1.6 18.08,17.51 18.54,17.97 18.54,29.58 19.56,30.6 19.56,35.06 19.41,35.21 J2.8

### Text on the board
Top: 1
Route2: 2
Route15: 3
Bottom: 4 | v02
Measures: Units in Inches
tDocu: Four Layer Board | 1oz Outer Layer / 0.5oz Inner Layer / JLC0416H-7628 Stackup | Lead Free HASL | 1.6mm Thickness | Elias Santistevan